# EAGLE design RSC (EAGLE 9.3.0)
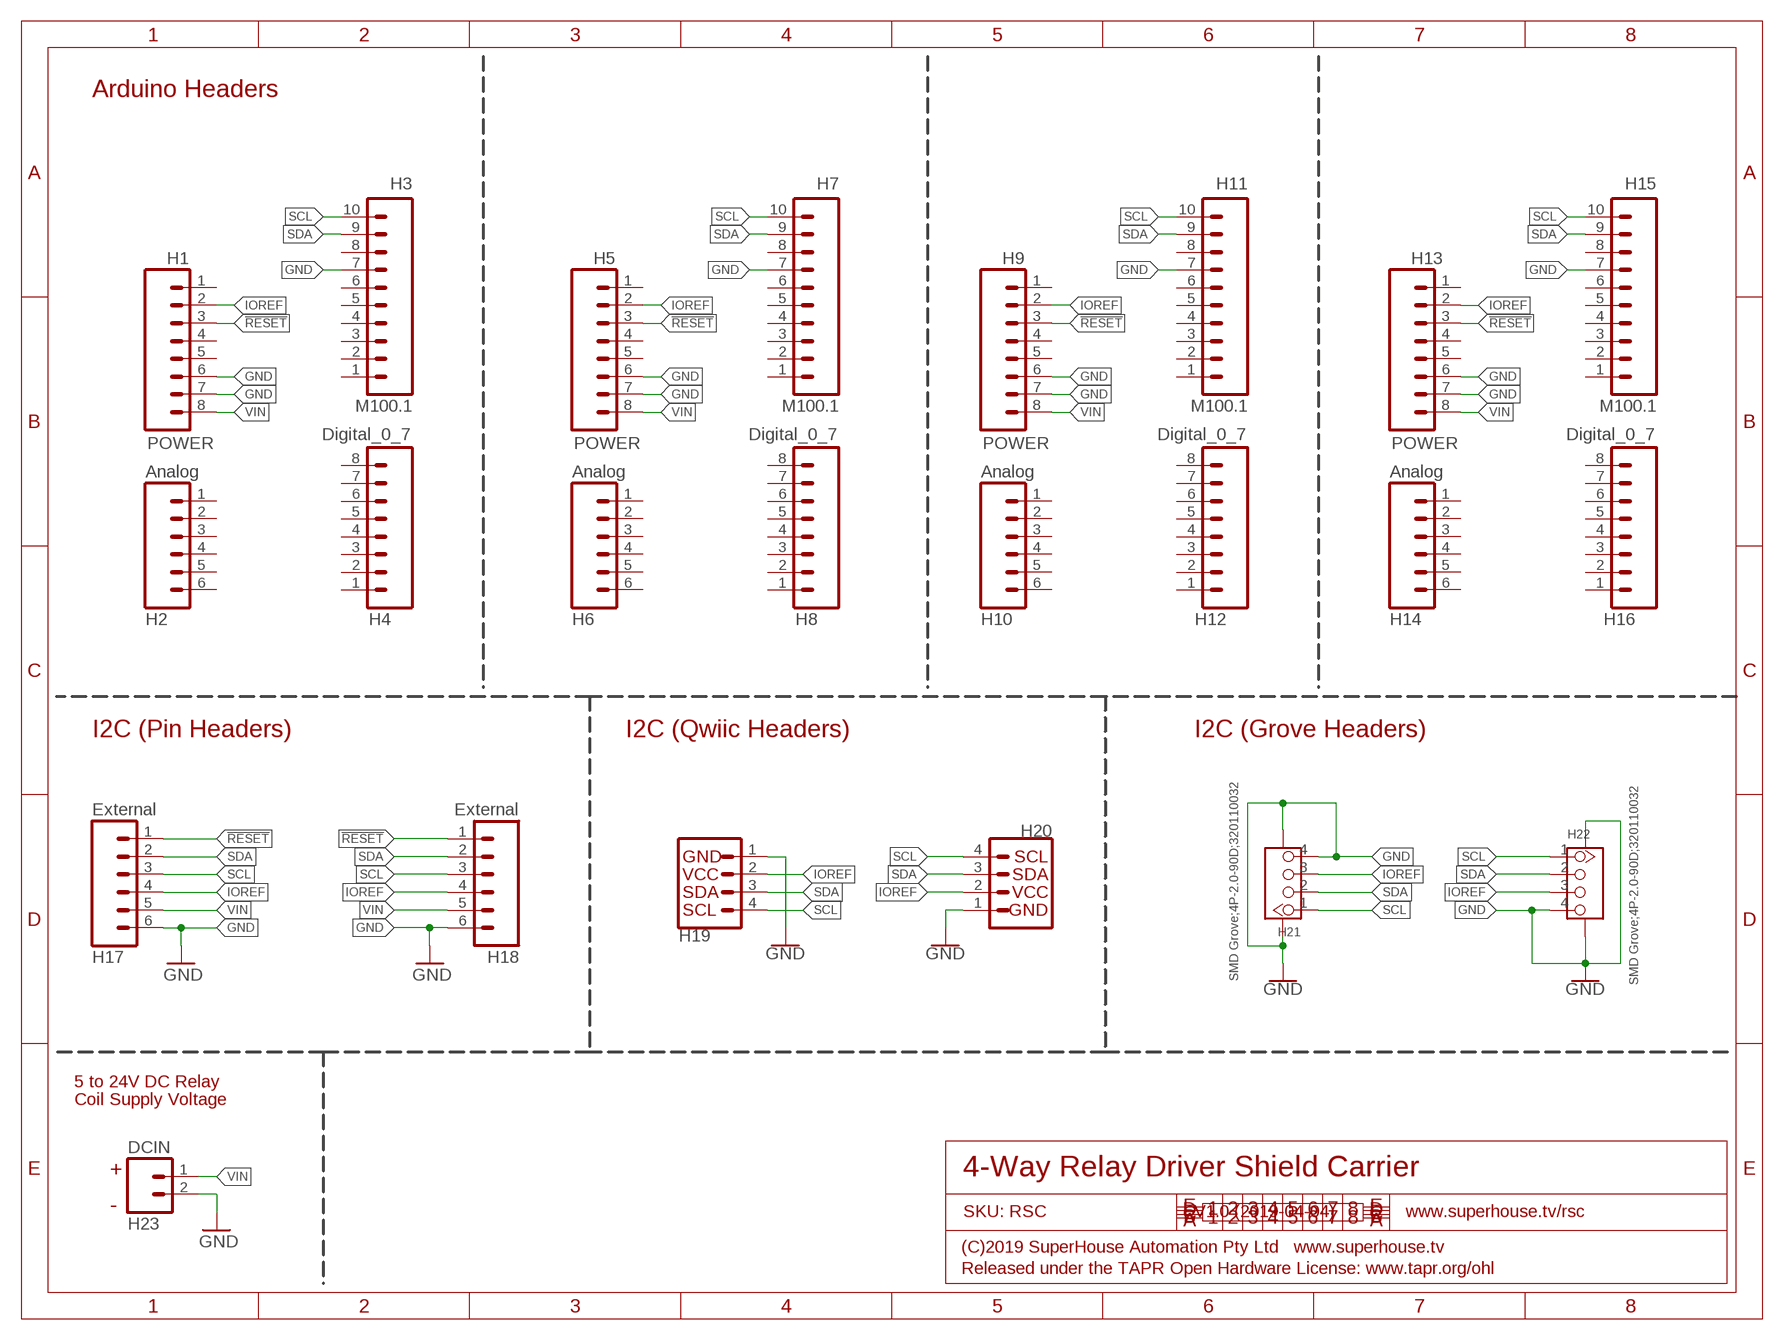
[diagram p0: schematic, sheet 1]

## Parts
H1  POWER  M08  [1X08]
H2  Analog  M06SIP  [1X06]
H3  M100.1  [1X10]
H4  Digital_0_7  M08  [1X08]
H5  POWER  M08  [1X08]
H6  Analog  M06SIP  [1X06]
H7  M100.1  [1X10]
H8  Digital_0_7  M08  [1X08]
H9  POWER  M08  [1X08]
H10  Analog  M06SIP  [1X06]
H11  M100.1  [1X10]
H12  Digital_0_7  M08  [1X08]
H13  POWER  M08  [1X08]
H14  Analog  M06SIP  [1X06]
H15  M100.1  [1X10]
H16  Digital_0_7  M08  [1X08]
H17  External  M06SIP  [1X06]
H18  External  M06SIP  [1X06]
H19  QWIIC_CONNECTORJS-1MM  [1X04_1MM_RA]
H20  QWIIC_CONNECTORJS-1MM  [1X04_1MM_RA]
H21  SMD Grove;4P-2.0-90D;320110032  GROVE-CONNECTOR-SMD'90D'  [HW4-SMD-2.0-90D]
H22  SMD Grove;4P-2.0-90D;320110032  GROVE-CONNECTOR-SMD'90D'  [HW4-SMD-2.0-90D]
H23  DCIN  M023.5MM  [SCREWTERMINAL-3.5MM-2]

## Nets
!RESET: H1.3 H5.3 H9.3 H13.3 H17.1 H18.1
GND: H1.6 H1.7 H3.7 H5.6 H5.7 H7.7 H9.6 H9.7 H11.7 H13.6 H13.7 H15.7 H17.6 H18.6 H19.1 H20.1 H21.4 H21.SS1 H21.SS2 H22.4 H22.SS1 H22.SS2 H23.2
IOREF: H1.2 H5.2 H9.2 H13.2 H17.4 H18.4 H19.2 H20.2 H21.3 H22.3
SCL: H3.10 H7.10 H11.10 H15.10 H17.3 H18.3 H19.4 H20.4 H21.1 H22.1
SDA: H3.9 H7.9 H11.9 H15.9 H17.2 H18.2 H19.3 H20.3 H21.2 H22.2
VIN: H1.8 H5.8 H9.8 H13.8 H17.5 H18.5 H23.1
Unconnected: H1.1 H1.4 H1.5 H2.1 H2.2 H2.3 H2.4 H2.5 H2.6 H3.1 H3.2 H3.3 H3.4 H3.5 H3.6 H3.8 H4.1 H4.2 H4.3 H4.4 H4.5 H4.6 H4.7 H4.8 H5.1 H5.4 H5.5 H6.1 H6.2 H6.3 H6.4 H6.5 H6.6 H7.1 H7.2 H7.3 H7.4 H7.5 H7.6 H7.8 H8.1 H8.2 H8.3 H8.4 H8.5 H8.6 H8.7 H8.8 H9.1 H9.4 H9.5 H10.1 H10.2 H10.3 H10.4 H10.5 H10.6 H11.1 H11.2 H11.3 H11.4 H11.5 H11.6 H11.8 H12.1 H12.2 H12.3 H12.4 H12.5 H12.6 H12.7 H12.8 H13.1 H13.4 H13.5 H14.1 H14.2 H14.3 H14.4 H14.5 H14.6 H15.1 H15.2 H15.3 H15.4 H15.5 H15.6 H15.8 H16.1 H16.2 H16.3 H16.4 H16.5 H16.6 H16.7 H16.8

## Notes on the sheet
- Arduino Headers
- I2C (Pin Headers) | I2C (Qwiic Headers) | I2C (Grove Headers)
- 5 to 24V DC Relay
- Coil Supply Voltage
- + | 4-Way Relay Driver Shield Carrier
- -
- SKU: RSC | V1.0 (2019-04-04) | www.superhouse.tv/rsc
- (C)2019 SuperHouse Automation Pty Ltd   www.superhouse.tv
- Released under the TAPR Open Hardware License: www.tapr.org/ohl

## Library data of the parts
H1 H4 H5 H8 H9 H12 H13 H16 = freetronics:M08: Header 8 Standard 8-pin 0.1" header. Use with straight break away headers (SKU : PRT-00116), right angle break away headers (PRT-00553), swiss pins (PRT-00743), machine pins (PRT-00117), and female headers (PRT-00115).
H2 H6 H10 H14 H17 H18 = freetronics:M06: Header 6 Standard 6-pin 0.1" header. Use with straight break away headers (SKU : PRT-00116), right angle break away headers (PRT-00553), swiss pins (PRT-00743), machine pins (PRT-00117), and female headers (PRT-00115). Molex polarized connector foot print use with SKU : PRT-08094 with associated crimp pins and housings. NOTES ON THE VARIANTS LOCK and LOCK_LONGPADS... This footprint was designed to help hold the alignment of a through-hole component (i.e. 6-pin header) while soldering it into place. You may notice that each hole has been shifted either up or down by 0.005 of an inch from it's more standard position (which is a perfectly straight line). This slight alteration caused the pins (the squares in the middle) to touch the edges of the holes. Because they are alternating, it causes a "brace" to hold the component in place. 0.005 has proven to be the perfect amount of "off-center" position when using our standard breakaway headers. Although looks a little odd when you look at the bare footprint, once you have a header in there, the alteration is very hard to notice. Also, if you push a header all the way into place, it is covered up entirely on the bottom side. This idea of altering the position of holes to aid alignment will be further integrated into the Sparkfun Library for other footprints. It can help hold any component with 3 or more connection pins.
H3 H7 H11 H15 = freetronics-original:M10: Header 10 Standard 10-pin 0.1" header. Use with straight break away headers (SKU : PRT-00116), right angle break away headers (PRT-00553), swiss pins (PRT-00743), machine pins (PRT-00117), and female headers (PRT-00115).
H19 H20 = SparkFun-Connectors:QWIIC_CONNECTOR: SparkFun I2C Standard Qwiic Connector An SMD 1mm pitch JST connector makes it easy and quick (get it? Qwiic?) to connect I2C devices to each other. The Qwiic system <http://www.sparkfun.com/qwiic> enables fast and solderless connection between popular platforms and various sensors and actuators. We carry 200mm <https://www.sparkfun.com/products/14204>, 100mm <https://www.sparkfun.com/products/14205>, 50mm <https://www.sparkfun.com/products/14206>, and breadboard friendly <https://www.sparkfun.com/products/14207> Qwiic cables. We also offer 10 pcs strips <https://www.sparkfun.com/products/14323> the SMD connectors.; PROD_ID: CONN-13694
H21 H22 = Connector-new:GROVE-CONNECTOR-SMD: 4P-SMD-2.0:320110030;4P-SMD-2.0-90D:320110032
H23 = freetronics-master-v1.1:M02: Header 2 Standard 2-pin 0.1" header. Use with straight break away headers (SKU : PRT-00116), right angle break away headers (PRT-00553), swiss pins (PRT-00743), machine pins (PRT-00117), and female headers (PRT-00115). Molex polarized connector foot print use with SKU : PRT-08233 with associated crimp pins and housings.

## Board
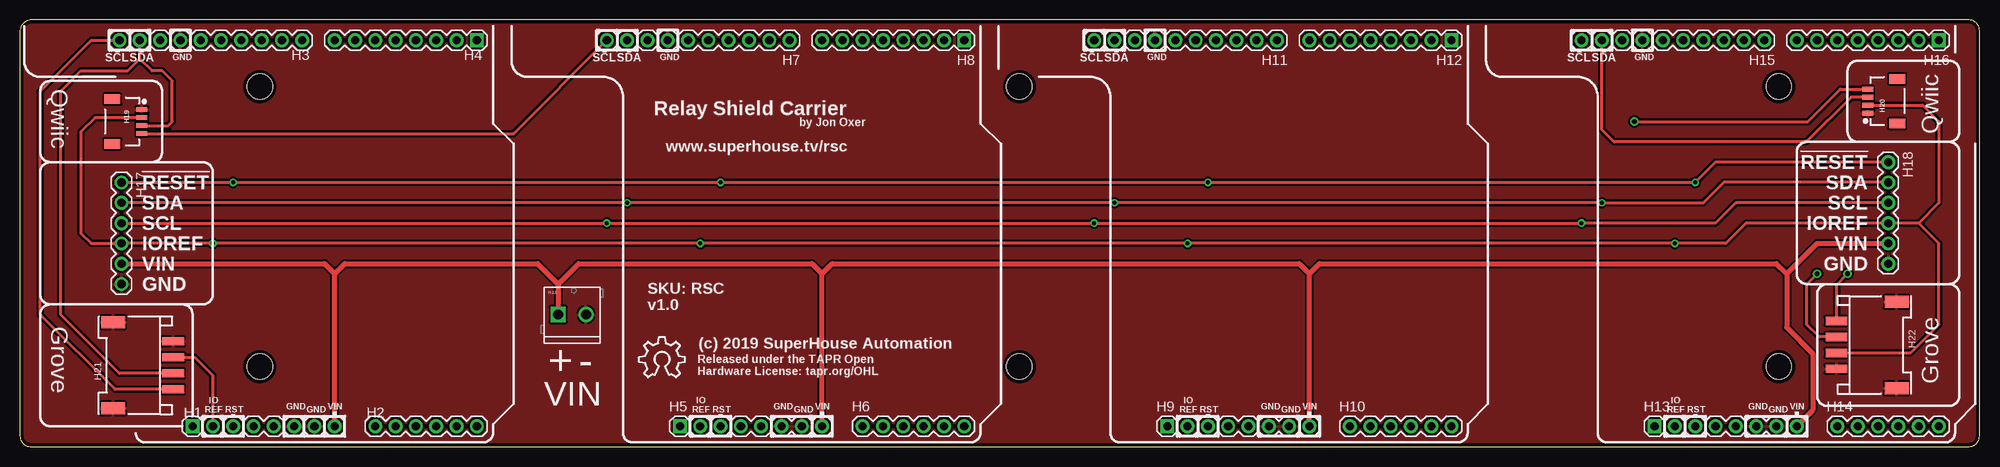
[diagram p1: board, top side]
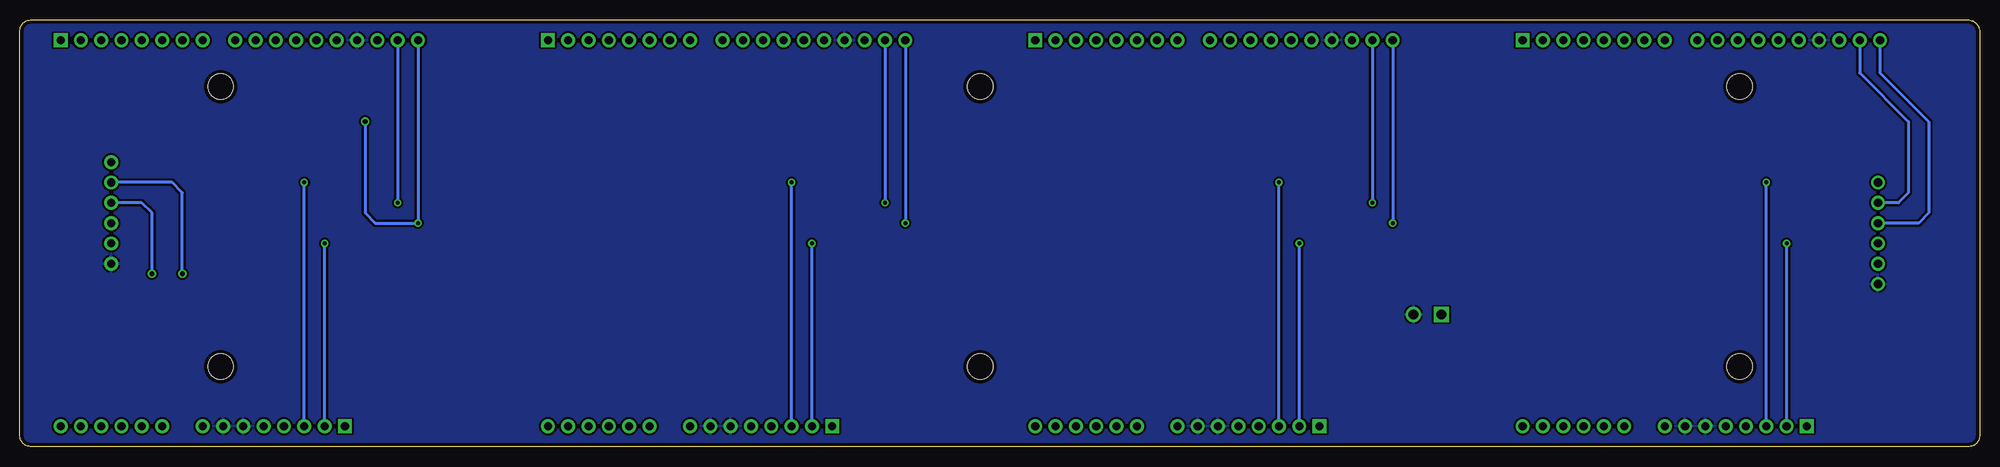
[diagram p2: board, bottom side, seen from below]

Size 245.11 x 53.34 mm. Coordinates in mm from the lower left corner, seen from the top.
Outline: 0,1.27 arc90 1.27,0 243.84,0 arc90 245.11,1.27 245.11,52.07 arc90 243.84,53.34 1.27,53.34 arc74 0,52.07 0,1.27
Copper layers (1*16): Top 0.035mm / dielectric 1.5mm / Bottom 0.035mm
Design rules "default *": minimum track width 10mil, minimum drill 19mil, track to track 10mil, track to pad 12mil, pad to pad 12mil, via to via 12mil, smd to smd 8mil, copper to edge 18mil, drill to drill 8mil, minimum pad ring 14mil, minimum via ring 8mil, stop-mask expansion 4mil, vias tented up to drill 0mil, thermal gap 10mil
Holes 3.2 mm at 30,10 30,45 125,45 125,10 220,10 220,45

### Footprints (pad centres in the part's own frame; a part is rotated, then mirrored left to right if it is on the bottom)
1X08 = drill 1.016 square: 1 0,0 | drill 1.016: 2 2.54,0; 3 5.08,0; 4 7.62,0; 5 10.16,0; 6 12.7,0; 7 15.24,0; 8 17.78,0
1X06 = drill 1.016: 1 0,0; 2 2.54,0; 3 5.08,0; 4 7.62,0; 5 10.16,0; 6 12.7,0
1X10 = drill 1.016: 1 0,0; 2 2.54,0; 3 5.08,0; 4 7.62,0; 5 10.16,0; 6 12.7,0; 7 15.24,0; 8 17.78,0; 9 20.32,0; 10 22.86,0
1X04_1MM_RA = smd 0.6 x 1.35: 1 -1.5,0; 2 -0.5,0; 3 0.5,0; 4 1.5,0 | smd 1.2 x 2: NC1 2.8,-3.675; NC2 -2.8,-3.675
HW4-SMD-2.0-90D = smd 1.01 x 2.74: 1 -3,-0.1; 2 -1,-0.1; 3 1,-0.1; 4 3,-0.1 | smd 1.5 x 3: SS1 -5.4,7.4; SS2 5.4,7.4
SCREWTERMINAL-3.5MM-2 = drill 1.2 square: 1 0,0 | drill 1.2: 2 3.5,0

### Placement (x,y rotation side)
H1  21.59,2.54 0 top
H2  44.45,2.54 0 top
H3  35.31,50.8 180 top
H4  57.15,50.8 180 top
H5  82.55,2.54 0 top
H6  105.41,2.54 0 top
H7  96.27,50.8 180 top
H8  118.11,50.8 180 top
H9  143.51,2.54 0 top
H10  166.37,2.54 0 top
H11  157.23,50.8 180 top
H12  179.07,50.8 180 top
H13  204.47,2.54 0 top
H14  227.33,2.54 0 top
H15  218.19,50.8 180 top
H16  240.03,50.8 180 top
H17  12.7,33.02 270 top
H18  233.68,35.56 270 top
H19  15.24,40.64 270 top
H20  231.14,43.18 90 top
H21  19.05,10.16 90 top
H22  227.33,12.7 270 top
H23  67.31,16.51 0 top
U$6  [OSHW_10X200_NOTEXT]  77.47,8.64 0 top

### Tracks (layer width: path | path; a pad name or v marks a point on that pad's centre or on a via)
!RESET  (via drill 0.5)
  Top 0.406: H17.1 v26.67,33.02 v87.63,33.02 v148.59,33.02 v209.55,33.02 212.09,35.56 H18.1
  Bottom 0.406: H1.3 v26.67,33.02 | H5.3 v87.63,33.02 | H9.3 v148.59,33.02 | H13.3 v209.55,33.02
GND
  pour Bottom: 0,52.07 arc-74 1.27,53.34 243.84,53.34 arc-74 245.11,52.07 245.11,1.27 arc-90 243.84,0 1.27,0 arc-90 0,1.27
  pour Top: 0,52.07 arc-74 1.27,53.34 243.84,53.34 arc-74 245.11,52.07 245.11,1.27 arc-90 243.84,0 1.27,0 arc-90 0,1.27
IOREF  (via drill 0.5)
  Top 0.406: H19.2 9.39,41.14 7.62,39.37 7.62,26.67 8.89,25.4 H17.4 v24.13,25.4 v85.09,25.4 v146.05,25.4 v207.01,25.4 213.36,25.4 215.9,27.94 H18.4 237.49,27.94 | H21.3 21.86,11.16 24.13,8.89 H1.2 | H20.2 237.99,42.68 240.03,40.64 240.03,30.48 237.49,27.94 | H22.3 236.49,11.7 240.03,15.24 240.03,25.4 237.49,27.94
  Bottom 0.406: H1.2 v24.13,25.4 | H5.2 v85.09,25.4 | H9.2 v146.05,25.4 | H13.2 v207.01,25.4
SCL  (via drill 0.5, 0.61)
  Top 0.406: H17.3 v73.41,27.94 v134.37,27.94 v195.33,27.94 212.09,27.94 214.63,30.48 H18.3 | H19.4 61.75,39.14 H7.10 | H21.1 11.89,7.16 2.54,16.51 2.54,44.45 8.89,50.8 H3.10 | H22.1 227.23,20.22 v228.6,21.59 | v201.93,40.64 223.64,40.64 227.68,44.68 H20.4
  Bottom 0.406: H15.10 v195.33,27.94 200.66,27.94 201.93,29.21 v201.93,40.64 | H11.10 v134.37,27.94 | H7.10 v73.41,27.94 | H3.10 12.45,46.74 6.35,40.64 6.35,29.21 7.62,27.94 H17.3 | v228.6,21.59 228.6,29.21 229.87,30.48 H18.3
SDA  (via drill 0.5, 0.61)
  Top 0.406: H18.2 213.11,33.02 210.57,30.48 v197.87,30.48 v136.91,30.48 v75.95,30.48 H17.2 | H19.3 18.55,40.14 19.05,40.64 19.05,45.72 17.78,46.99 16.51,46.99 14.99,48.51 | 14.99,48.51 H3.9 | H21.2 12.43,9.16 5.08,16.51 5.08,44.45 7.62,46.99 13.46,46.99 14.99,48.51 | H20.3 229.05,43.68 223.47,38.1 199.39,38.1 197.87,39.62 H15.9 | H22.2 225.06,13.7 223.52,15.24 223.52,20.32 v224.79,21.59
  Bottom 0.406: H15.9 v197.87,30.48 | H11.9 v136.91,30.48 | H7.9 v75.95,30.48 | H3.9 14.99,46.74 8.89,40.64 8.89,31.75 10.16,30.48 H17.2 | v224.79,21.59 224.79,31.75 226.06,33.02 H18.2
VIN
  Top 0.61: H17.5 38.1,22.86 39.37,21.59 | 39.37,21.59 40.64,22.86 64.77,22.86 67.31,20.32 | 67.31,20.32 69.85,22.86 99.06,22.86 100.33,21.59 | 100.33,21.59 101.6,22.86 160.02,22.86 161.29,21.59 | 161.29,21.59 162.56,22.86 219.71,22.86 220.98,21.59 | 220.98,21.59 224.79,25.4 H18.5 | H5.8 100.33,21.59 | H1.8 39.37,21.59 | H9.8 161.29,21.59 | 67.31,20.32 H23.1 | 220.98,21.59 220.98,14.89 224.25,11.62 224.25,4.54 H13.8

### Text on the board
tPlace: SCL | SDA | GND | SCL | SDA | GND | SCL | SDA | GND | SCL | SDA | GND | Qwiic | Relay Shield Carrier | by Jon Oxer | Qwiic | www.superhouse.tv/rsc | !RESET | !RESET | SDA | SDA | SCL | SCL | IOREF | IOREF | VIN | VIN | GND | GND | SKU: RSC | v1.0 | Grove | (c) 2019 SuperHouse Automation | + | - | Released under the TAPR Open / Hardware License: tapr.org/OHL | Grove | IO | GND | VIN | VIN | IO | GND | VIN | IO | GND | VIN | IO | GND | VIN | REF | RST | GND | REF | RST | GND | REF | RST | GND | REF | RST | GND